# Altium schematic sheet 05-multimodal-analogfrontend.SchDoc
size A3; CompanyName: ICAS Lab.; DrawnBy: Isil Isiksalan; SheetNumber: 3; SheetTotal: 11
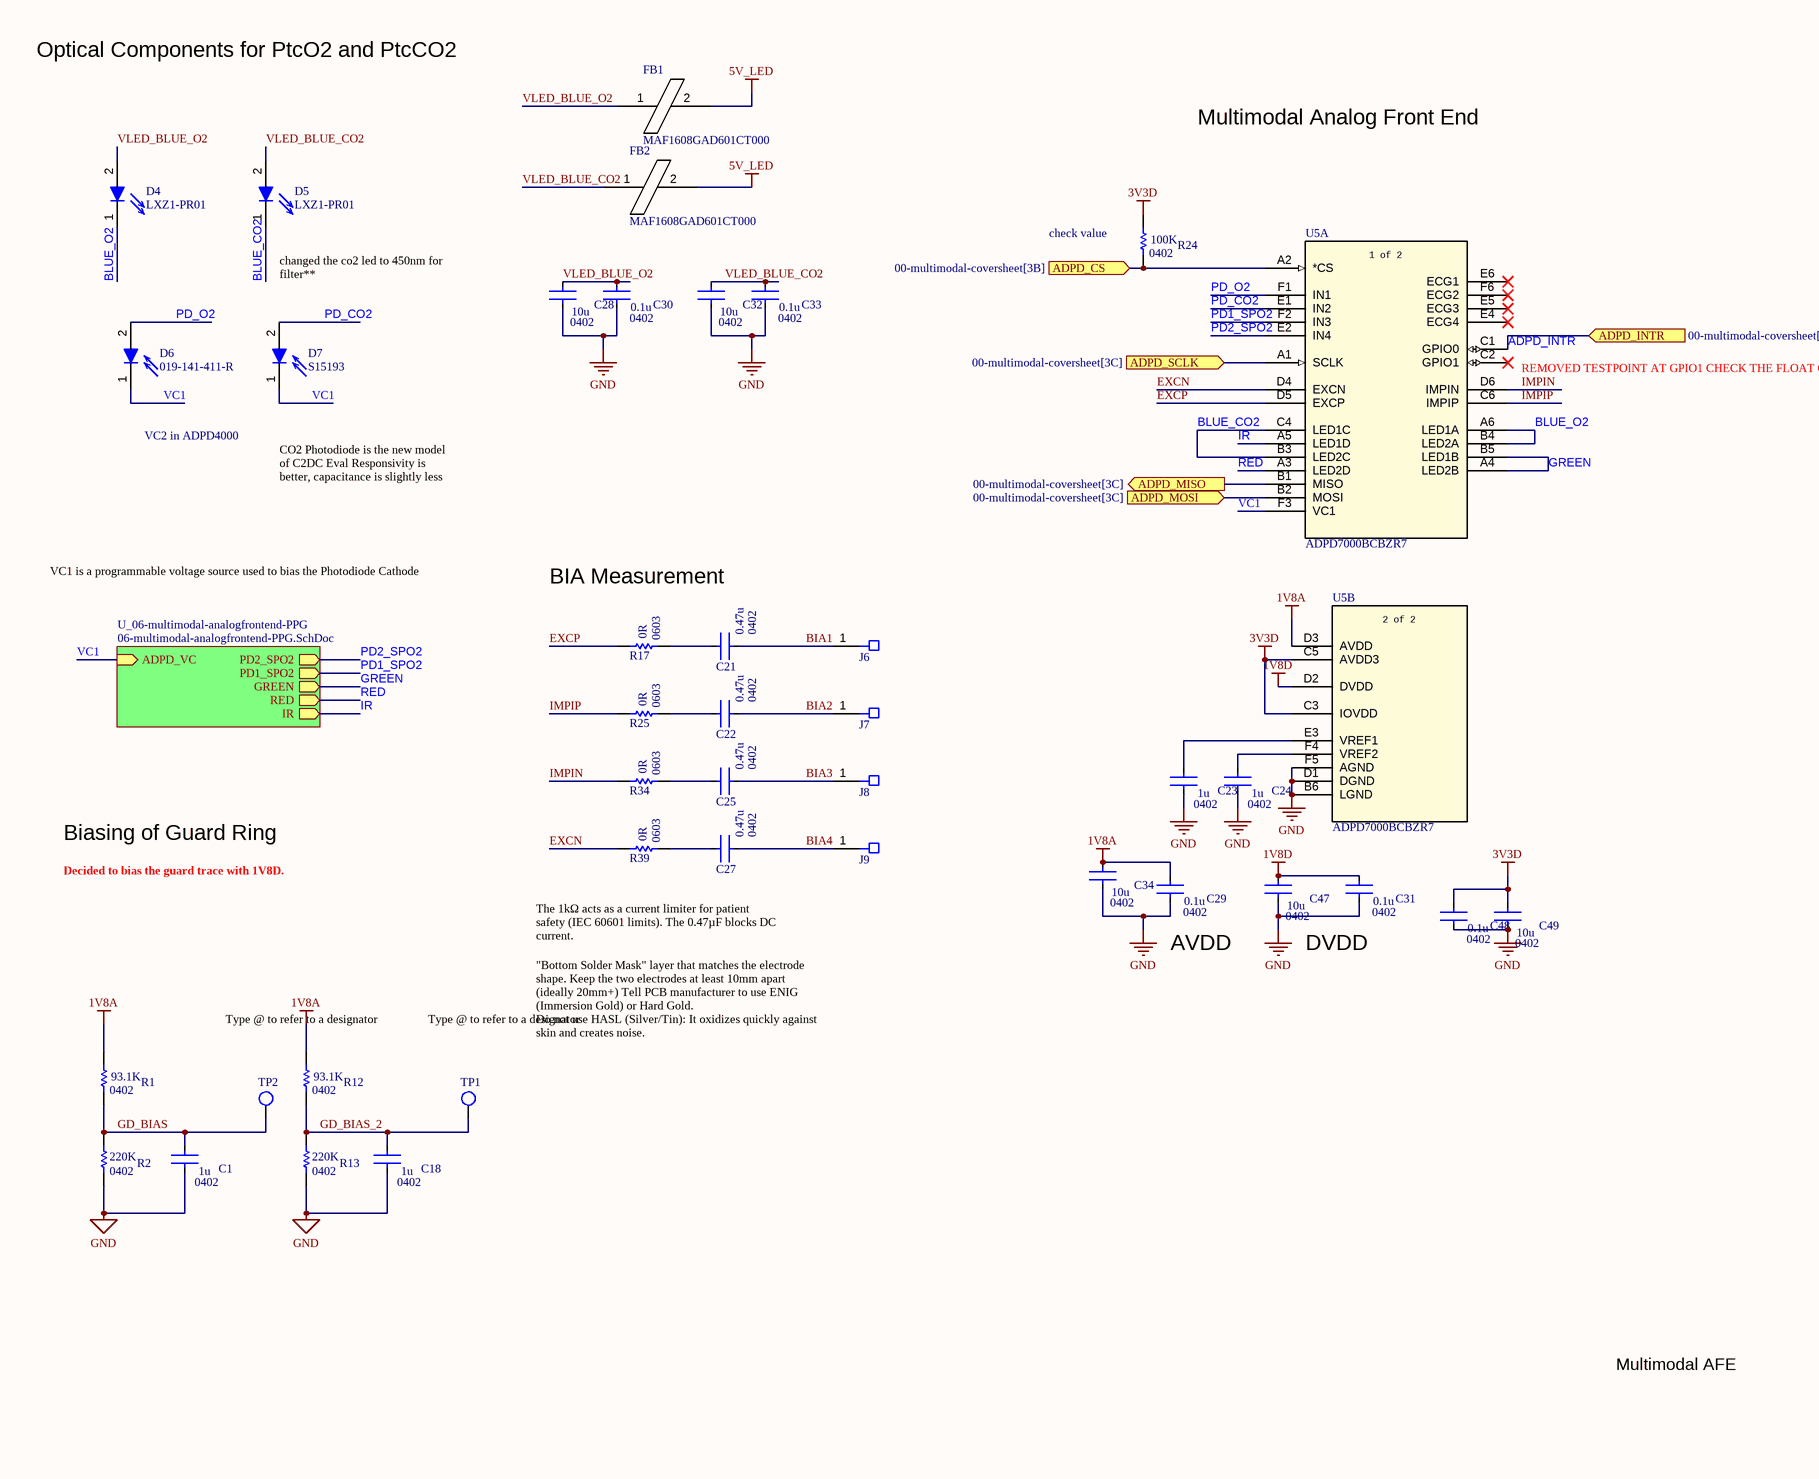
[diagram p0: 05-multimodal-analogfrontend.SchDoc, left]
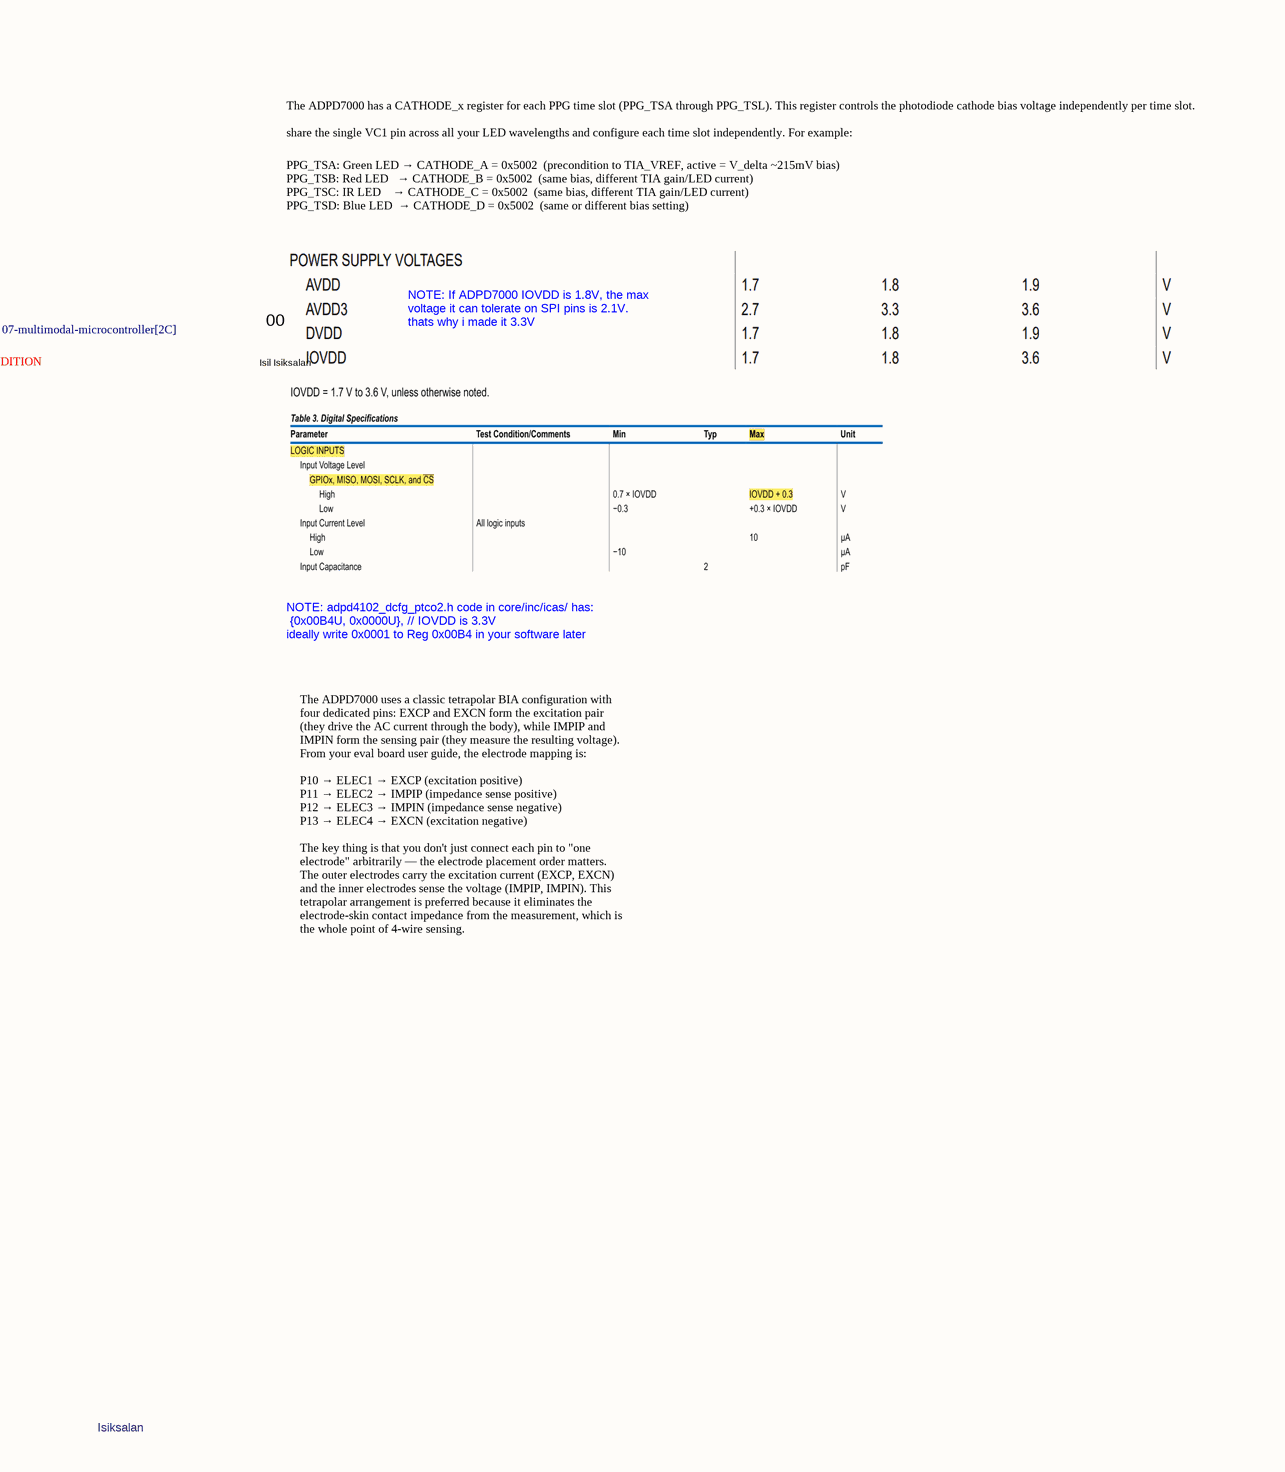
[diagram p1: 05-multimodal-analogfrontend.SchDoc, right]

## Parts
C1  C1005X5R1V105K050BC  [CAPTDK0402]  (value not drawn)
C18  C1005X5R1V105K050BC  [CAPTDK0402]  (value not drawn)
C21  GRM155R60J474KE19D  [CAPTDK0402]  (value not drawn)
C22  GRM155R60J474KE19D  [CAPTDK0402]  (value not drawn)
C23  C1005X5R1V105K050BC  [CAPTDK0402]  (value not drawn)
C24  C1005X5R1V105K050BC  [CAPTDK0402]  (value not drawn)
C25  GRM155R60J474KE19D  [CAPTDK0402]  (value not drawn)
C27  GRM155R60J474KE19D  [CAPTDK0402]  (value not drawn)
C28  0402W106M6R3HI  [CAPTDK0402]  (value not drawn)
C29  C1005X7R1H104K050BB  [CAPTDK0402]  (value not drawn)
C30  C1005X7R1H104K050BB  [CAPTDK0402]  (value not drawn)
C31  C1005X7R1H104K050BB  [CAPTDK0402]  (value not drawn)
C32  0402W106M6R3HI  [CAPTDK0402]  (value not drawn)
C33  C1005X7R1H104K050BB  [CAPTDK0402]  (value not drawn)
C34  GRM155R61A106ME11D  [CAPTDK0402]  (value not drawn)
C47  GRM155R61A106ME11D  [CAPTDK0402]  (value not drawn)
C48  C1005X7R1H104K050BB  [CAPTDK0402]  (value not drawn)
C49  GRM155R61A106ME11D  [CAPTDK0402]  (value not drawn)
D4  LXZ1-PR01  [LXZ1-PR01]
D5  LXZ1-PR01  [LXZ1-PR01]
D6  019-141-411-R  [RED-PD]
D7  S15193  [S15193]
FB1  MAF1608GAD601CT000  [INDMURT0603]
FB2  MAF1608GAD601CT000  [INDMURT0603]
J6  electrode  [electrode]  (value not drawn)
J7  electrode  [electrode]  (value not drawn)
J8  electrode  [electrode]  (value not drawn)
J9  electrode  [electrode]  (value not drawn)
R1  RMCF0402FT93K1  [RES-STACK-POLE-0402]  (value not drawn)
R2  RMCF0402FT220K  [RES-STACK-POLE-0402]  (value not drawn)
R12  RMCF0402FT93K1  [RES-STACK-POLE-0402]  (value not drawn)
R13  RMCF0402FT220K  [RES-STACK-POLE-0402]  (value not drawn)
R17  RMCF0603ZT0R00  [RES-STACK-POLE-0603]  (value not drawn)
R24  RMCF0402FT100K  [RES-STACK-POLE-0402]  (value not drawn)
R25  RMCF0603ZT0R00  [RES-STACK-POLE-0603]  (value not drawn)
R34  RMCF0603ZT0R00  [RES-STACK-POLE-0603]  (value not drawn)
R39  RMCF0603ZT0R00  [RES-STACK-POLE-0603]  (value not drawn)
TP1  TESTPOINT_S  [TESTPOINT_S]  (value not drawn)  (no BOM)
TP2  TESTPOINT_S  [TESTPOINT_S]  (value not drawn)  (no BOM)
U5  ADPD7000BCBZR7  [ADPD7001_36-WLCSP]  (parts A,B of 2)

## Sub-sheets
U_06-multimodal-analogfrontend-PPG = 06-multimodal-analogfrontend-PPG.SchDoc: PD2_SPO2 (out), PD1_SPO2 (out), ADPD_VC (in), GREEN (out), RED (out), IR (out)

## Ports
ADPD_CS (in, see 00-multimodal-coversheet[3B]), ADPD_INTR (in, see 00-multimodal-coversheet[3B], 07-multimodal-microcontroller[2C]), ADPD_MISO (out, see 00-multimodal-coversheet[3C]), ADPD_MOSI (in, see 00-multimodal-coversheet[3C]), ADPD_SCLK (in, see 00-multimodal-coversheet[3C])

## Nets
1V8A: C29.1 C34.1 R1.2 R12.2 U5.D3(AVDD)
1V8D: C31.1 C47.1 U5.D2(DVDD)
3V3D: C48.1 C49.1 R24.2 U5.C3(IOVDD) U5.C5(AVDD3)
5V_LED: FB1.2 FB2.2
GND: C1.2 C18.2 C23.2 C24.2 C28.2 C29.2 C30.2 C31.2 C32.2 C33.2 C34.2 C47.2 C48.2 C49.2 R2.1 R13.1 U5.B6(LGND) U5.D1(DGND) U5.F5(AGND)
ADPD_CS: R24.1 U5.A2(*CS) ; port ADPD_CS
ADPD_INTR: U5.C1(GPIO0) ; port ADPD_INTR
ADPD_MISO: U5.B1(MISO) ; port ADPD_MISO
ADPD_MOSI: U5.B2(MOSI) ; port ADPD_MOSI
ADPD_SCLK: U5.A1(SCLK) ; port ADPD_SCLK
BIA1: C21.2 J6.1
BIA2: C22.2 J7.1
BIA3: C25.2 J8.1
BIA4: C27.2 J9.1
BLUE_CO2: D5.1 U5.B3(LED2C) U5.C4(LED1C)
BLUE_O2: D4.1 U5.A6(LED1A) U5.B4(LED2A)
EXCN: R39.2 U5.D4(EXCN)
EXCP: R17.2 U5.D5(EXCP)
GD_BIAS: C1.1 R1.1 R2.2 TP2.1
GD_BIAS_2: C18.1 R12.1 R13.2 TP1.1
GREEN: U5.A4(LED2B) U5.B5(LED1B) ; sheet U_06-multimodal-analogfrontend-PPG/GREEN
IMPIN: R34.2 U5.D6(IMPIN)
IMPIP: R25.2 U5.C6(IMPIP)
IR: U5.A5(LED1D) ; sheet U_06-multimodal-analogfrontend-PPG/IR
PD1_SPO2: U5.F2(IN3) ; sheet U_06-multimodal-analogfrontend-PPG/PD1_SPO2
PD2_SPO2: U5.E2(IN4) ; sheet U_06-multimodal-analogfrontend-PPG/PD2_SPO2
PD_CO2: D7.2 U5.E1(IN2)
PD_O2: D6.2 U5.F1(IN1)
RED: U5.A3(LED2D) ; sheet U_06-multimodal-analogfrontend-PPG/RED
VC1: D6.1 D7.1 U5.F3(VC1) ; sheet U_06-multimodal-analogfrontend-PPG/ADPD_VC
VLED_BLUE_CO2: C32.1 C33.1 D5.2 FB2.1
VLED_BLUE_O2: C28.1 C30.1 D4.2 FB1.1
NetC21_1: C21.1 R17.1
NetC22_1: C22.1 R25.1
NetC23_1: C23.1 U5.E3(VREF1)
NetC24_1: C24.1 U5.F4(VREF2)
NetC25_1: C25.1 R34.1
NetC27_1: C27.1 R39.1

Not connected (* = marked no-connect by the designer): U5 C2(GPIO1)* E4(ECG4)* E5(ECG3)* E6(ECG1)* F6(ECG2)*

## Notes on the sheet
- Optical Components for PtcO2 and PtcCO2
- Multimodal Analog Front End
- The ADPD7000 has a CATHODE_x register for each PPG time slot (PPG_TSA through PPG_TSL). This register controls the photodiode cathode bias voltage independently per time slot.
- share the single VC1 pin across all your LED wavelengths and configure each time slot independently. For example:
- changed the co2 led to 450nm for filter**
- (near R24) check value
- PPG_TSA: Green LED → CATHODE_A = 0x5002  (precondition to TIA_VREF, active = V_delta ~215mV bias)
  PPG_TSB: Red LED   → CATHODE_B = 0x5002  (same bias, different TIA gain/LED current)
  PPG_TSC: IR LED    → CATHODE_C = 0x5002  (same bias, different TIA gain/LED current)
  PPG_TSD: Blue LED  → CATHODE_D = 0x5002  (same or different bias setting)
- 00
- NOTE: If ADPD7000 IOVDD is 1.8V, the max voltage it can tolerate on SPI pins is 2.1V. thats why i made it 3.3V
- REMOVED TESTPOINT AT GPIO1 CHECK THE FLOAT CONDITION
- Isil Isiksalan
- VC2 in ADPD4000
- CO2 Photodiode is the new model of C2DC Eval Responsivity is better, capacitance is slightly less
- VC1 is a programmable voltage source used to bias the Photodiode Cathode
- BIA Measurement
- NOTE: adpd4102_dcfg_ptco2.h code in core/inc/icas/ has:
  {0x00B4U, 0x0000U}, // IOVDD is 3.3V
  ideally write 0x0001 to Reg 0x00B4 in your software later
- Biasing of Guard Ring
- Decided to bias the guard trace with 1V8D.
- (near C29) AVDD
- DVDD
- The ADPD7000 uses a classic tetrapolar BIA configuration with four dedicated pins: EXCP and EXCN form the excitation pair (they drive the AC current through the body), while IMPIP and IMPIN form the sensing pair (they measure the resulting voltage). From your eval board user guide, the electrode mapping is:
  P10 → ELEC1 → EXCP (excitation positive)
  P11 → ELEC2 → IMPIP (impedance sense positive)
  P12 → ELEC3 → IMPIN (impedance sense negative)
  P13 → ELEC4 → EXCN (excitation negative)
  The key thing is that you don't just connect each pin to "one electrode" arbitrarily — the electrode placement order matters. The outer electrodes carry the excitation current (EXCP, EXCN) and the inner electrodes sense the voltage (IMPIP, IMPIN). This tetrapolar arrangement is preferred because it eliminates the electrode-skin contact impedance from the measurement, which is the whole point of 4-wire sensing.
- Type @ to refer to a designator
- The 1kΩ acts as a current limiter for patient safety (IEC 60601 limits). The 0.47µF blocks DC current.
- "Bottom Solder Mask" layer that matches the electrode shape. Keep the two electrodes at least 10mm apart (ideally 20mm+) Tell PCB manufacturer to use ENIG (Immersion Gold) or Hard Gold.
  Do not use HASL (Silver/Tin): It oxidizes quickly against skin and creates noise.
- Multimodal AFE
- Isiksalan
- THIS DOCUMENT AND THE DATA DISCLOSED HEREIN OR
- HEREWITH IS THE PROPERTY OF ALTIUM LIMITED AND MAY
- DWG NO:
- REVISION
- REV:
- DESCRIPTION
- DATE
- APPROVED
- BE FREELY DISTRIBUTED IN WHOLE. NO RIGHTS ARE
- RESERVED OR EXPRESS OR IMPLIED WARANTEE GIVEN.
- ENG:
- APPROVALS
- PROJECT
- DSN:
- CHK:
- REFERENCE DOCUMENTS
- PROJECT REVISION:
- TITLE
- DOCUMENT REVISION:
- DESIGN ITEM:
- BOM:
- FAB DWG:
- PCB DWG:
- ASSY DWG:
- SCALE:
- A3
- SIZE
- CAGE CODE
- FILE NAME
- DWG NO.
- SHEET
- OF
- REV
- (in symbol 0402W106M6R3HI) 10u; 0402
- (in symbol ADPD7000BCBZR7, part A) 1 of 2
- (in symbol ADPD7000BCBZR7, part B) 2 of 2
- (in symbol C1005X5R1V105K050BC) 1u; 0402
- (in symbol C1005X7R1H104K050BB) 0.1u; 0402
- (in symbol GRM155R60J474KE19D) 0.47u; 0402
- (in symbol GRM155R61A106ME11D) 10u; 0402
- (in symbol RMCF0402FT93K1) 93.1K; 0402
- (in symbol RMCF0402FT100K) 100K; 0402
- (in symbol RMCF0402FT220K) 220K; 0402
- (in symbol RMCF0603ZT0R00) 0R; 0603

## Library data of the parts
C1 C18 C23 C24 = C1005X5R1V105K050BC: CAP CER 1UF 35V X5R 0402; Supplier 1: Digi-Key; Supplier Part Number 1: 445-9073-1-ND
C21 C22 C25 C27 = GRM155R60J474KE19D: CAP CER 0.47UF 6.3V X5R 0402; Supplier 1: Avnet; Supplier Part Number 1: GRM155R60J474KE19D
C28 C32 = 0402W106M6R3HI: CAP SMD,0402,X5R,10UF,20%,6.3V
C29-C31 C33 C48 = C1005X7R1H104K050BB: CAP CER 0.1UF 50V X7R 0402; Supplier 1: Digi-Key; Supplier Part Number 1: 445-5932-1-ND
C34 C47 C49 = GRM155R61A106ME11D: CAP CER 10UF 10V X5R 0402; Supplier 1: Digi-Key; Supplier Part Number 1: 490-GRM155R61A106ME11DCT-ND
D4 D5 = LXZ1-PR01: LED LUXEON Z RYL BLUE 450NM 2SMD; Manufacturer: Philips Lumileds; Wavelength: 447.5nm; Forward Current: 500mA; Viewing Angle: 125°; Number of LEDs: 1; Forward Voltage: 2.9V; Lens Style: Rectangular,Round; Supplier 1: Digi-Key; Manufacturer Part Number: LXZ1-PR01; RoHS: Yes; Category: LEDs; Stock 1: 4609; Pricing 1: 1=2.57000, 10=1.71400, 100=1.31940, 500=1.19264, 1000=1.16469 (USD); Mount: Surface Mount; Case/Package: SMD/SMT; Number of Pins: 2; Color: Blue; Lens Color: Blue; Min Operating Temperature: -40°C; Max Operating Temperature: 135°C; Dominant Wavelength: 447.5nm; Test Current: 500mA; Illumination Color: Blue; Packaging: Tape and Reel; Package Quantity: 2000; Length: 1.7mm; Width: 1.3mm; Height: 0.66mm; Lead Free: Lead Free; ComponentLink1URL: https://datasheet.ciiva.com/25632/0900766b81251f28-25632625.pdf?src-supplier=RSComponents; ComponentLink1Description: https://datasheet.ciiva.com/25632/0900766b81251f28-25632625.pdf?src-supplier=RSComponents; ComponentLink2URL: https://datasheet.ciiva.com/16345/ds105-16345515.pdf?src-supplier=Future+Electronics; ComponentLink2Description: https://datasheet.ciiva.com/16345/ds105-16345515.pdf?src-supplier=Future+Electronics; Supplier Part Number 1: 1416-1058-1-ND
D6 = 019-141-411-R: PHOTODIODE RED MICRO SMT; Supplier 1: Digi-Key; Supplier Part Number 1: 209-019-141-411-RCT-ND
D7 = S15193: PHOTODIODE PIN 380 NM-1000 NM 20V 0.64 A/W SMD; Manufacturer: Hamamatsu; ComponentLink1Description: Datasheet; ComponentLink1URL: https://www.hamamatsu.com/resources/pdf/ssd/s13773_kpin1088e.pdf; Manufacturer Part Number: S15193; Supplier 1: Hamamatsu; Supplier 1 Part Number: S15193
FB1 FB2 = MAF1608GAD601CT000: FERRITE BEAD 120 OHM 0603 1LN; Supplier 1: Newark; Supplier Part Number 1: MAF1608GAD601CT000
J6-J9 = electrode: one pad opening
R1 R12 = RMCF0402FT93K1: RES 93.1K OHM 1% 1/16W 0402; Mfr_Name: Stackpole International; Manufacturer_Part_Number: RMCF0603FT80K6; Copyright: Copyright (C) 2022 Ultra Librarian. All rights reserved.; Digi-Key_Part_Number_1: RMCF0603FT80K6CT-ND; Digi-Key_Part_Number_2: RMCF0603FT80K6DKR-ND; Digi-Key_Part_Number_3: RMCF0603FT80K6TR-ND; RefDes: RefDes; Type: DEV; Supplier 1: Digi-Key; Supplier Part Number 1: RMCF0402FT93K1CT-ND
R2 R13 = RMCF0402FT220K: RES 220K OHM 1% 1/16W 0402; Supplier 1: Digi-Key; Supplier Part Number 1: RMCF0402FT220KCT-ND
R17 R25 R34 R39 = RMCF0603ZT0R00: RES 0 OHM JUMPER 1/10W 0603; Supplier 1: Digi-Key; Supplier Part Number 1: RMCF0603ZT0R00CT-ND
R24 = RMCF0402FT100K: RES 100K OHM 1% 1/16W 0402; Supplier 1: Digi-Key; Supplier Part Number 1: RMCF0402FT100KCT-ND
TP1 TP2 = TESTPOINT_S: Testpoint Surface Pad
U5 = ADPD7000BCBZR7: Multimodal Sensor Front End; Manufacturer_Name: Analog Devices Inc; Type: Interface; Copyright: Copyright (C) 2026 Ultra Librarian. All rights reserved.; Manufacturer_Part_Number: ADPD7000BCBZR7; RefDes: RefDes